# Altium schematic sheet power.SchDoc
size A3; SheetNumber: 3; SheetTotal: 5
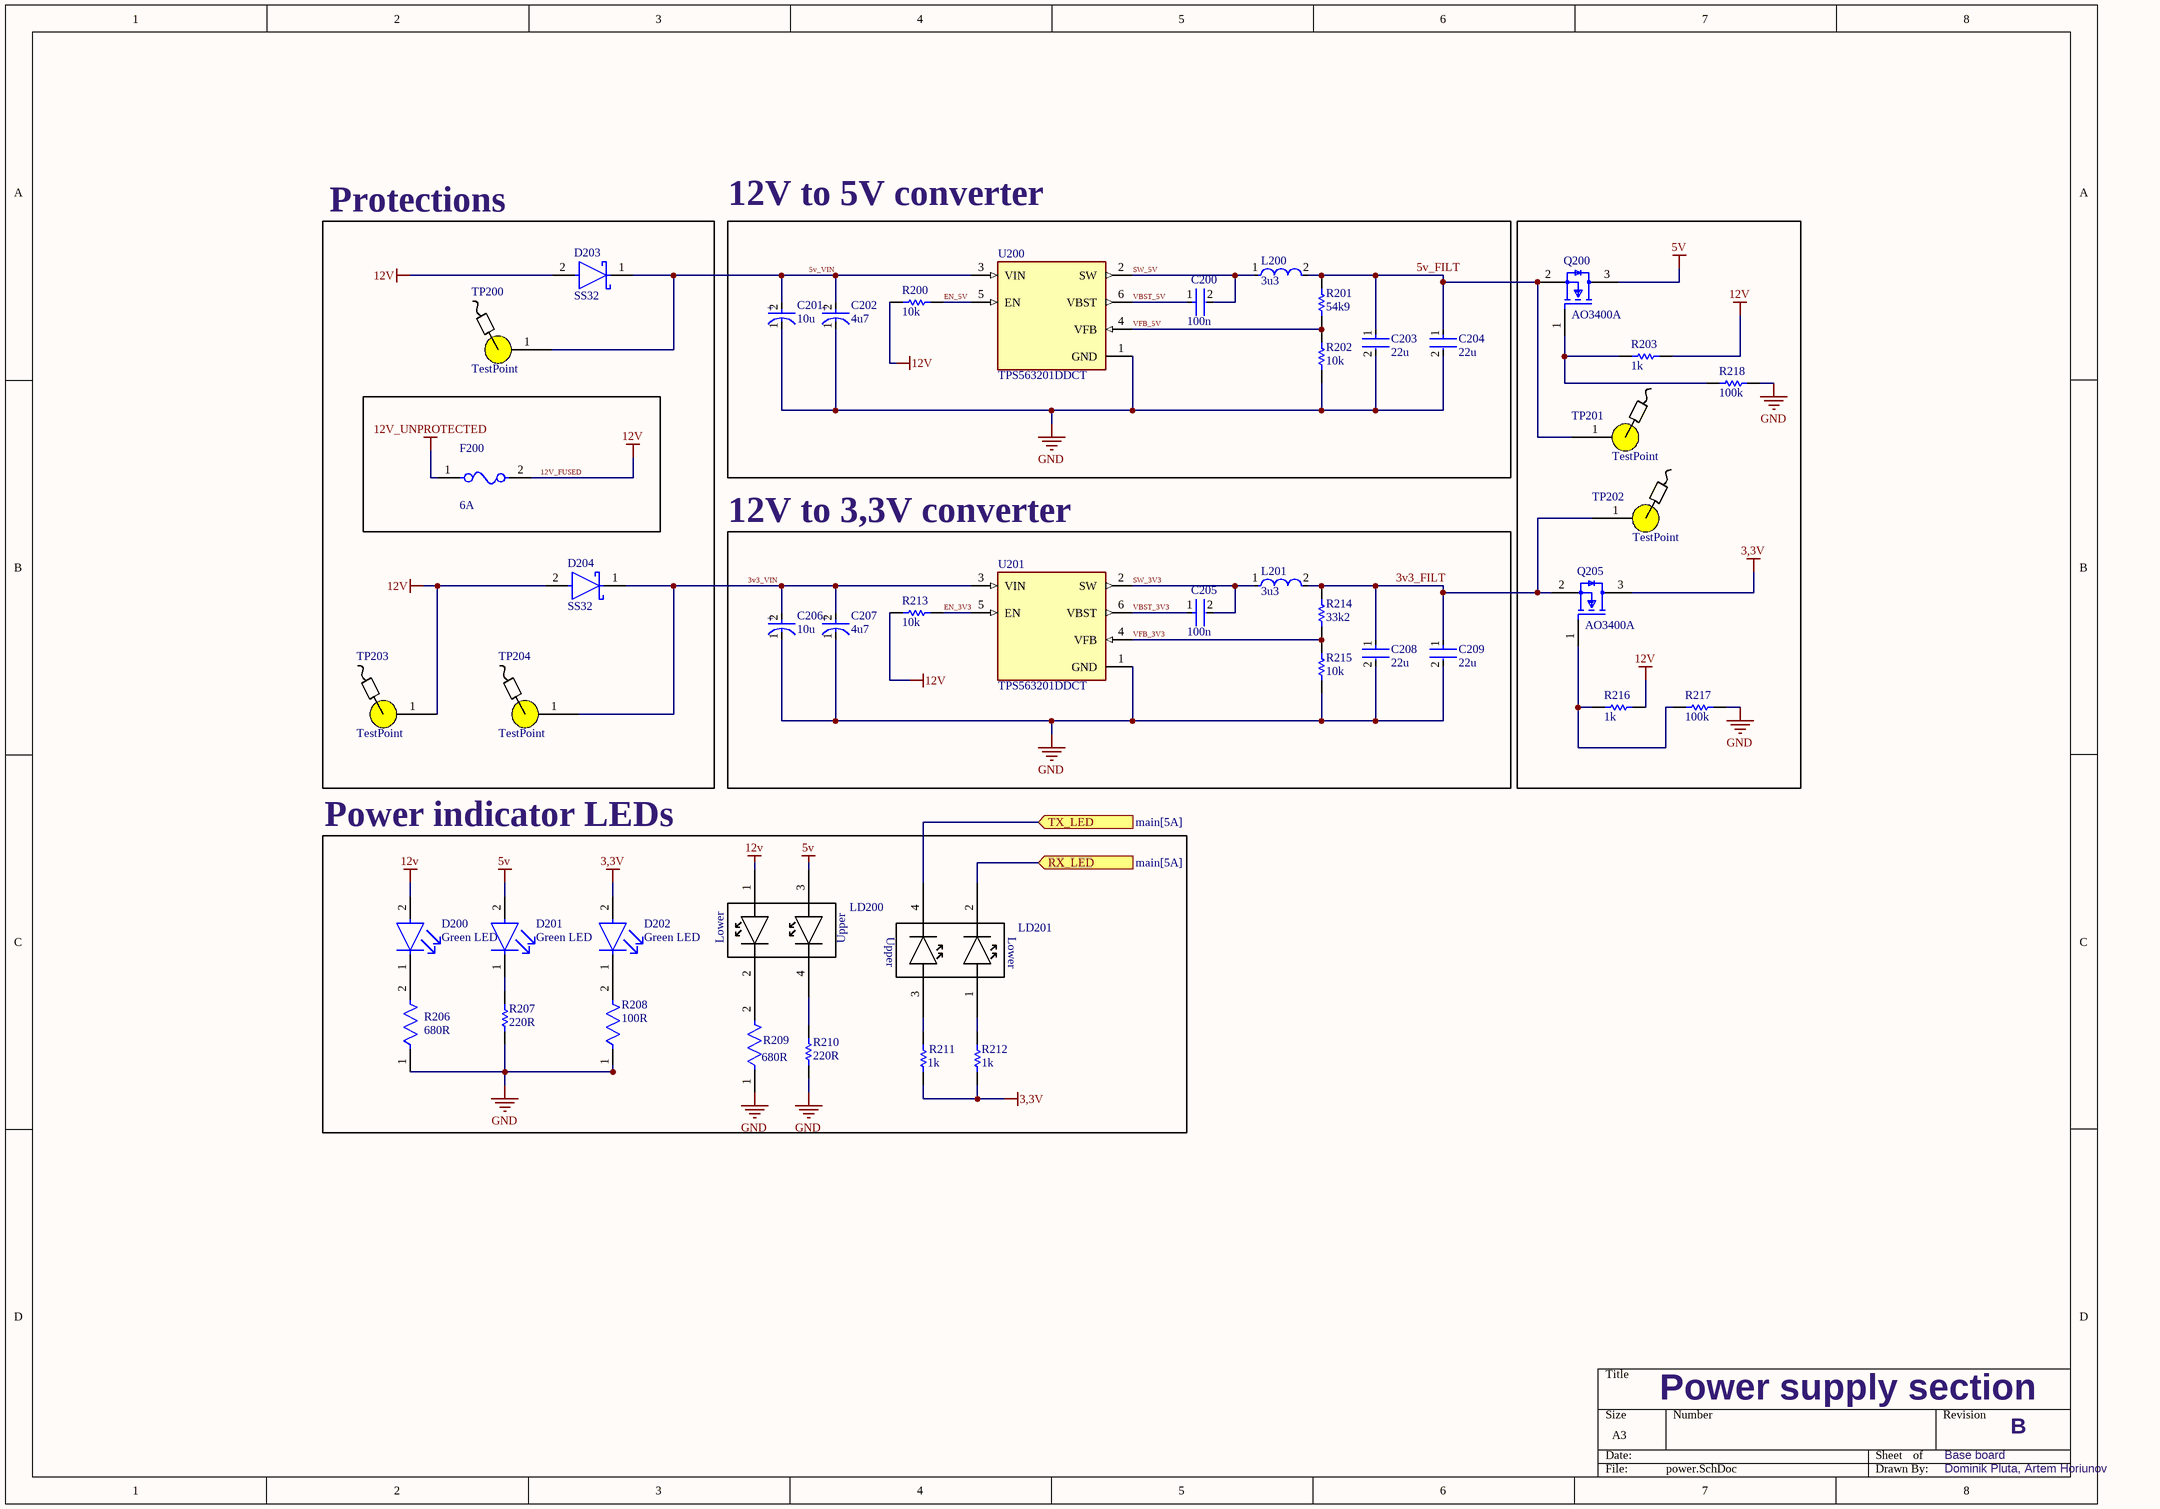
[diagram p0: power.SchDoc]

## Parts
C200  100n  [FP-C0603C-CF-MFG]
C201  10u  [FP-POSCAP-B2-MFG]
C202  4u7  [FP-POSCAP-B2-MFG]
C203  22u  [FP-C3216-085-0_2-MFG]
C204  22u  [FP-C3216-085-0_2-MFG]
C205  100n  [FP-C0603C-CF-MFG]
C206  10u  [FP-POSCAP-B2-MFG]
C207  4u7  [FP-POSCAP-B2-MFG]
C208  22u  [FP-C3216-085-0_2-MFG]
C209  22u  [FP-C3216-085-0_2-MFG]
D200  Green LED  [FP-HSME-C191-MFG]
D201  Green LED  [FP-HSME-C191-MFG]
D202  Green LED  [FP-HSME-C191-MFG]
D203  SS32  [FP-403AG-MFG]
D204  SS32  [FP-403AG-MFG]
F200  6A  [FP-0466-MFG]
L200  3u3  [FP-SRP4020TA-MFG]
L201  3u3  [FP-SRP4020TA-MFG]
LD200  (no value)  [LED_HOLDER]
LD201  (no value)  [LED_HOLDER]
Q200  AO3400A  [FP-SOT23-MFG]
Q205  AO3400A  [FP-SOT23-MFG]
R200  10k  [RESC0603(1608)_N]
R201  54k9  [RESC0603(1608)_N]
R202  10k  [RESC0603(1608)_N]
R203  1k  [RESC0603(1608)_N]
R206  680R  [FP-CRCW0603-e3-MFG]
R207  220R  [RESC1608X55X25ML10T15]
R208  100R  [FP-RC0603-0_55-MFG]
R209  680R  [FP-CRCW0603-e3-MFG]
R210  220R  [RESC1608X55X25ML10T15]
R211  1k  [RESC0603(1608)_N]
R212  1k  [RESC0603(1608)_N]
R213  10k  [RESC0603(1608)_N]
R214  33k2  [RESC0603(1608)_N]
R215  10k  [RESC0603(1608)_N]
R216  1k  [RESC0603(1608)_N]
R217  100k  [RESC0603(1608)_N]
R218  100k  [RESC0603(1608)_N]
TP200  TestPoint  [TestPoint]
TP201  TestPoint  [TestPoint]
TP202  TestPoint  [TestPoint]
TP203  TestPoint  [TestPoint]
TP204  TestPoint  [TestPoint]
U200  TPS563201DDCT  [SOT95P280X110-6N]
U201  TPS563201DDCT  [SOT95P280X110-6N]

## Blocks framed on the sheet
Protections: D203 D204 F200 TP200 TP203 TP204
12V to 5V converter: C200-C204 L200 R200-R202 U200
12V to 3,3V converter: C205-C209 L201 R213-R215 U201
Power indicator LEDs: D200-D202 LD200 LD201 R206-R212

## Ports
RX_LED (in, see main[5A]), TX_LED (in, see main[5A])

## Nets
3,3V: D202.2(A) Q205.3(D) R211.1 R212.1
5v: D201.2(A) LD200.3 Q200.3(D)
12V_FUSED: D200.2(A) D203.2(A) D204.2(A) F200.2 LD200.1 R200.2 R203.1 R213.2 R216.1 TP203.1  [also labelled 12v]
12V_UNPROTECTED: F200.1
GND: C201.1(C) C202.1(C) C203.2 C204.2 C206.1(C) C207.1(C) C208.2 C209.2 R202.1 R206.1 R207.1 R208.1 R209.1 R210.1 R215.1 R217.2 R218.2 U200.1(GND) U201.1(GND)
3v3_FILT: C208.1 C209.1 L201.2 Q205.2(S) R214.2 TP202.1
3v3_VIN: C206.2(A) C207.2(A) D204.1(C) TP204.1 U201.3(VIN)
5v_FILT: C203.1 C204.1 L200.2 Q200.2(S) R201.2 TP201.1
5v_VIN: C201.2(A) C202.2(A) D203.1(C) TP200.1 U200.3(VIN)
EN_3V3: R213.1 U201.5(EN)
EN_5V: R200.1 U200.5(EN)
RX_LED: LD201.2 ; port RX_LED
SW_3V3: C205.2 L201.1 U201.2(SW)
SW_5V: C200.2 L200.1 U200.2(SW)
TX_LED: LD201.4 ; port TX_LED
VBST_3V3: C205.1 U201.6(VBST)
VBST_5V: C200.1 U200.6(VBST)
VFB_3V3: R214.1 R215.2 U201.4(VFB)
VFB_5V: R201.1 R202.2 U200.4(VFB)
NetD200_1: D200.1(C) R206.2
NetD201_1: D201.1(C) R207.2
NetD202_1: D202.1(C) R208.2
NetLD200_2: LD200.2 R209.2
NetLD200_4: LD200.4 R210.2
NetLD201_1: LD201.1 R212.2
NetLD201_3: LD201.3 R211.2
NetQ200_1: Q200.1(G) R203.2 R218.1
NetQ205_1: Q205.1(G) R216.2 R217.1

## Notes on the sheet
- Power supply section
- Base board
- B
- Dominik Pluta, Artem Horiunov
- (in symbol CMP-05428-001070-1) +
- (in symbol DoubleStack_Side_Led_3mm) Lower; Upper

## Library data of the parts
C200 C205 = CMP-2006-03061-2: CAP CER 0.1UF 50V X7R 0603; Manufacturer: KEMET; Manufacturer Part Number: C0603C104K5RACTU; Tolerance: 0.1; Temperature Coefficient: 30ppm/°C; Material: Ceramic; Automotive Grade: Grade 1; Value: 0.10 μF; Temperature: -55°C to +125°C; RoHS: TRUE; Temperature Range High: +125°C; Lead Free: Yes; Octopart: https://octopart.com/c0603c104k5ractu-kemet-139244; Digikey Description: CAP CER 0.1UF 50V X7R 0603; Category: Cap; Package: C0603C-CF; ComponentLink2Description: Datasheet; Temperature Range Low: -55°C; Device Class L1: Passive Components; Voltage Rating: 50 V; Automotive: Yes; Device Class L3: Ceramic Capacitors; ComponentLink2URL: https://api.kemet.com/component-edge/download/datasheet/C0603C100J5GACAUTO.pdf; Capacitance: 0.10 μF; Device Class L2: Capacitors; Temperature Characteristic: X7R; Height: 0.87mm
C201 C202 C206 C207 = CMP-05428-001070-1: Molded Tantalum Polymer Capacitor 10uF 20% 16V life 2000Hours SMD 1411; Leakage Current: 48uA; ESR (Equivalent Series Resistance): 100mR; Ripple Current: 800mA; Dissipation Factor: 10%; Polarity: Polar; Voltage Rating: 16V; REACH SVHC: No SVHC; Width: 2.8mm; Construction: Flat; Features: General Purpose; Life (Hours): 2000Hour; Radiation Hardening: No; Length: 3.5mm; Termination: SMD/SMT; Series: POSCAP™ TQC; Voltage Rating (DC): 16V; Mount: Surface Mount; Min Operating Temperature: -55°C; Lead Free: Lead Free; Tolerance: 20%; Number of Pins: 2; Case/Package: 1411; Case Code (Metric): 3528; Height: 1.9mm; Height - Seated (Max): 0.083inch; Package Quantity: 2000; Capacitance: 10uF; RoHS Compliant: Yes; Case Code (Imperial): 1210; Packaging: Tape and Reel; Voltage: 16V; Max Operating Temperature: 105°C; Depth: 2.8mm
C203 C204 C208 C209 = CMP-08246-004858-1: Multilayer Ceramic Capacitors 22μF ±20% 6.3V X5R SMD 1206; Capacitance: 22uF; RoHS Compliant: Yes; Case/Package: 1206; Length: 0.126inch; Thickness: 0.037inch; Min Operating Temperature: -55°C; REACH SVHC: No SVHC; Number of Pins: 2; Weight: 0.000571oz; Resistor Type: Ceramic; Dielectric: X5R; Tolerance: 20%; Max Operating Temperature: 85°C; Package Quantity: 1; Series: C; Depth: 1.6mm; Width: 0.063inch; Lead Free: Lead Free; Dielectric Material: Ceramic; Case Code (Imperial): 1206; Mount: Surface Mount; Voltage Rating: 6.3V; Voltage Rating (DC): 6.3V; Case Code (Metric): 3216; Height: 0.85mm; Packaging: Cut Tape; Termination: SMD/SMT
D200-D202 = CMP-18399-000013-1: LED GREEN DIFFUSED 0603 SMD; Manufacturer: Broadcom; Manufacturer Part Number: HSME-C191; Forward Current: 20mA; Reverse Voltage: 5V; Forward Voltage: 2.1V; Viewing Angle: 170°; Wavelength: 572nm; Power Dissipation: 52mW; Max Junction Temp: +95°C; Luminous Intensity: 50mcd; Led Orientation: Top View; Peak Emmision Wavelength: 570nm; Package: 0; Category: Diode; ComponentLink2URL: https://docs.broadcom.com/docs/AV02-0976EN; ComponentLink2Description: Datasheet; Device Class L2: LEDs; Digikey Description: LED GREEN DIFFUSED 0603 SMD; Height: 0.7mm; RoHS: TRUE; Colour: Green; Lead Free: Yes; Device Class L1: Optoelectronics; Device Class L3: unset; Temperature Range High: +85°C; Automotive: No; Temperature: -40°C to +85°C; Octopart: https://octopart.com/hsme-c191-broadcom-71131261; Mouser Description: Standard LEDs - SMD AlInGaP Green; Temperature Range Low: -40°C
D203 D204 = CMP-00278-84331622-1: SS32 Rectifier Diode, Schottky, 1 Phase, 1 Element, 3A, 20V V(RRM), Silicon, DO-214AB; Manufacturer Lifecycle Status: ACTIVE; Forward Voltage: 500mV; Max Forward Surge Current (Ifsm): 100A; Max Reverse Leakage Current: 500µA; Max Junction Temperature (Tj): 150°C; Element Configuration: Single; Max Power Dissipation: 2.27W; Polarity: Standard; Number of Elements: 1; RoHS: Compliant; Forward Current: 3A; Height: 2.65mm; Max Reverse Voltage (DC): 20V; NexarPartId: 84331622; Max Repetitive Reverse Voltage (Vrrm): 20V; Schedule B: 8541100080, 8541100080; Lead Free: Lead Free; Current Rating: 3A; Radiation Hardening: No; Mount: Surface Mount; Max Operating Temperature: 150°C; Average Rectified Current: 3A; Number of Pins: 2; Output Current: 3A; Packaging: Cut Tape; Min Operating Temperature: -55°C; Max Surge Current: 100A; REACH SVHC: No SVHC; Case/Package: SMC; Weight: 300mg; Lifecycle Status: Production; Peak Reverse Current: 500µA; Number of Terminals: 2; Width: 6.25mm; Length: 7.15mm; Voltage Rating (DC): 20V; Peak Non-Repetitive Surge Current: 100A
F200 = CMP-08605-000093-1: Voltage Rating: 63V; Body Material: Thermoplastic; Fuse Type: Board Mount (Cartridge Style Excluded); Resistance: 220mR; Current Rating: 750mA; DC Cold Resistance: 111mR; Approvals: UL; Package Quantity: 5000; Radiation Hardening: No; Width: 0.06inch; Mount: Surface Mount; Case Code (Metric): 3216; Length: 3.18mm; Depth: 1.52mm; Series: 466; Voltage Rating (AC): 63V; Case Code (Imperial): 1206; Voltage Rating (DC): 63V; Min Operating Temperature: -55°C; Height: 0.023inch; Working Voltage: 63V; RoHS Compliant: Yes; Packaging: Tape and Reel; Number of Pins: 2; Lead Free: Lead Free; Case/Package: 1206; Max Operating Temperature: 90°C; Termination: SMD/SMT; Fuse Current: 750mA
L200 L201 = CMP-07248-000008-1: MDA4020-3R3M / 3.3uH ±20% 3.1A 65mΩ SMD,4.1x4.5mm Inductors (SMD) ROHS; Manufacturer: Bourns; Manufacturer Part Number: SRP4020TA-3R3M; Shielding: true; Test Frequency: 100kHz; Self Resonant Frequency: 40MHz; Saturation Current: 4A; Q Factor: 10; Series Resistance: 76mΩ; Automotive Grade: Grade 0; Core Material: Carbonyl Powder; Rms Current: 3.5A; Temperature Range High: +150°C; Height: 2.1mm; Temperature: -40°C to +150°C; RoHS: TRUE; Device Class L3: Fixed Inductors; Automotive: Yes; Octopart: https://octopart.com/srp4020ta-3r3m-bourns-47300338; Composition: Wirewound; Mouser Description: Ind Power Shielded Wirewound 3.3uH 20% 100KHz Carbonyl Powder 3.5A T/R; Category: Ind; ComponentLink2Description: Datasheet; ComponentLink2URL: https://www.bourns.com/docs/Product-Datasheets/SRP4020TA.pdf; Digikey Description: FIXED IND 3.3UH 3.5A 76 MOHM SMD; Lead Free: Yes; Temperature Range Low: -40°C; Inductance: 3.3uH; Tolerance: 20%; Package: SRP4020TA; Value: 3.3uH; Device Class L1: Passive Components; Device Class L2: Inductors
LD200 LD201 = DoubleStack_Side_Led_3mm
Q200 Q205 = CMP-83955-000006-1: MOSFET N-CH 30V 5.7A SOT23; Input Capacitance: 630pF; Number of Elements: 1; Rds On Max: 26.5mR; Max Power Dissipation: 1.4W; Gate to Source Voltage (Vgs): 12V; Min Operating Temperature: -55°C; Lead Free: Lead Free; Number of Pins: 3; Drain to Source Voltage (Vdss): 30V; Case/Package: SOT-23; Mount: Surface Mount; Continuous Drain Current (ID): 5.7A; Radiation Hardening: No; Packaging: Tape and Reel; Max Operating Temperature: 150°C; Power Dissipation: 1.4W
R200 R202 R203 R213 R215-R218 = CMP-1012-00081-1: 2K 0.1W 5% 0603 (1608 Metric)  SMD; Case-Metric: 1608; Value: 2000.00 Ohm; Case-EIA: 0603; Tolerance: 5 %; Technology: SMT; Power: 0.1 W
R201 R211 R212 R214 = CMP-1012-00081-1: 0.1W 1% 0603 (1608 Metric)  SMD; Tolerance: 5 %; Case-Metric: 1608; Value: 2000.00 Ohm; Case-EIA: 0603; Technology: SMT; Power: 0.1 W
R206 R209 = CMP-2000-03529-2: RES Thick Film, 680Ω, 1%, 0.1W, 100ppm/°C, 0603; Voltage Rating (DC): 75V; Max Power Dissipation: 100mW; Radiation Hardening: No; Case Code (Imperial): 0603; Number of Pins: 2; Termination: SMD/SMT; Lead Free: Lead Free; Contact Plating: Tin; Case Code (Metric): 1608; Max Operating Temperature: 155°C; Tolerance: 1%; Military Standard: Not; Features: Automotive AEC-Q200; Power Rating: 100mW; Width: 0.85mm; Depth: 0.85mm; Resistance: 680R; Height: 0.45mm; Case/Package: 0603; Min Operating Temperature: -55°C; Length: 1.55mm; Voltage Rating: 75V; Composition: Thick Film; Working Voltage: 75V; Temperature Coefficient: 100ppm/°C; Packaging: Tape and Reel; Package Quantity: 10; Weight: 7.1E-05oz; Number of Terminations: 2
R207 R210 = CMP-1659-00018-2: General Purpose Chip Resistors, 220 Ohm, +/- 1%, -55 to 155 degC, 0603 (1608 Metric), RoHS, Tape and Reel; RoHSCompliant: false; DatasheetVersion: Rev. 4, 04/2009; ComponentLink2Description: Datasheet; ComponentLink2URL: https://datasheet.ciiva.com/11808/0900766b80f96399-11808136.pdf; ComponentLink1URL: http://www.yageo.com/; ComponentLink1Description: Manufacturer URL; PackageReference: 0603; PackageDescription: 2-Pin Surface Mount Device, Body 1.6 x 0.8 mm
R208 = CMP-2100-03663-2: NexarPartId: 55402879; Voltage Rating: 50V; Power Rating: 100mW; Tolerance: 1%; Temperature Coefficient: 100ppm/°C; Resistance: 100Ω; Case/Package: 0603; Military Standard: Not; REACH SVHC: Unknown; Case Code (Metric): 0603; Max Operating Temperature: 155°C; Schedule B: 8533210045, 8533210045; Height: 450µm; Length: 1.6mm; Lead Free: Lead Free; Packaging: Tape & Reel; Case Code (Imperial): 0603; Composition: Thick Film; Min Operating Temperature: -55°C; Voltage Rating (DC): 50V; RoHS: Compliant; Depth: 800µm; Number of Pins: 2; Termination: SMD/SMT; Width: 800µm
U200 U201 = CMP-007-000000-1: Design Item ID: TPS563201DDCT; Component Type: Standard; Price: None; MP: TPS563201DDCT; Package: None; Source: TPS563201DDCT.SchLib; Value: *; Pin Count: 6; Availability: Unavailable